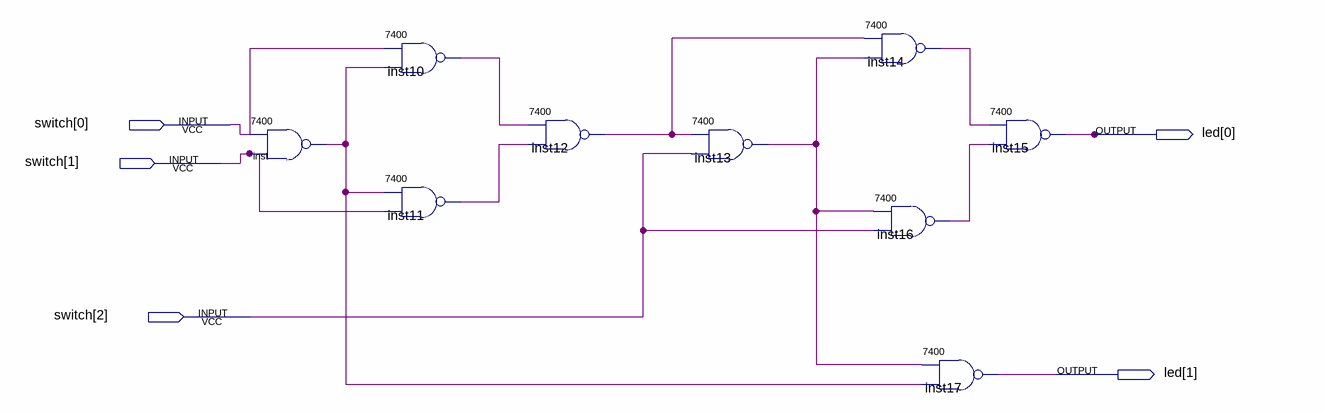
[diagram p0: schematic sheet]
// Quartus schematic pj202.bdf as structural Verilog: 9 symbols, 5 pins
module pj202 (
  input  [2:0] switch,
  output [1:0] led
);

  wire inst10_1, inst11_1, inst12_1, inst13_1, inst14_1, inst16_1, inst_1;

  \7400  inst (.\3 (switch[1]), .\2 (switch[0]), .\1 (inst_1));
  \7400  inst10 (.\3 (inst_1), .\2 (switch[0]), .\1 (inst10_1));
  \7400  inst11 (.\3 (switch[1]), .\2 (inst_1), .\1 (inst11_1));
  \7400  inst12 (.\3 (inst11_1), .\2 (inst10_1), .\1 (inst12_1));
  \7400  inst13 (.\3 (switch[2]), .\2 (inst12_1), .\1 (inst13_1));
  \7400  inst14 (.\3 (inst13_1), .\2 (inst12_1), .\1 (inst14_1));
  \7400  inst16 (.\3 (switch[2]), .\2 (inst13_1), .\1 (inst16_1));
  \7400  inst17 (.\3 (inst_1), .\2 (inst13_1), .\1 (led[1]));
  \7400  inst15 (.\3 (inst16_1), .\2 (inst14_1), .\1 (led[0]));
endmodule
